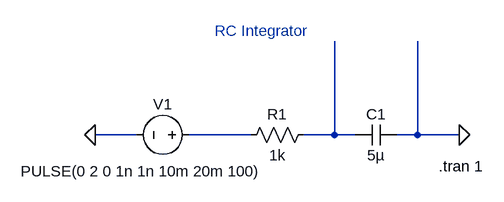
[diagram p0: schematic sch.asc]
sch.asc, the LTspice schematic file:
Version 4
SHEET 1 880 680
WIRE -32 160 -96 160
WIRE 144 160 48 160
WIRE 272 160 272 16
WIRE 272 160 224 160
WIRE 304 160 272 160
WIRE 400 160 400 16
WIRE 400 160 368 160
WIRE 464 160 400 160
FLAG -96 160 0
FLAG 464 160 0
SYMBOL res 240 144 R90
WINDOW 0 0 56 VBottom 2
WINDOW 3 32 56 VTop 2
SYMATTR InstName R1
SYMATTR Value 1k
SYMBOL cap 368 144 R90
WINDOW 0 0 32 VBottom 2
WINDOW 3 32 32 VTop 2
SYMATTR InstName C1
SYMATTR Value 5µ
SYMBOL voltage 64 160 R90
WINDOW 0 -32 56 VBottom 2
WINDOW 3 40 89 VTop 2
WINDOW 123 0 0 Left 0
WINDOW 39 0 0 Left 0
SYMATTR InstName V1
SYMATTR Value PULSE(0 2 0 1n 1n 10m 20m 100)
TEXT 432 208 Left 2 !.tran 1
TEXT 88 0 Left 2 ;RC Integrator

The netlist it stands for:
* sch.asc
R1 N002 N001 1k
C1 0 N002 5µ
V1 N001 0 PULSE(0 2 0 1n 1n 10m 20m 100)
.tran 1
* RC Integrator
.backanno
.end